# Altium schematic sheet RK3399_Display_HDMI_EDP.SchDoc
size A4; SheetNumber: 8; SheetTotal: 20
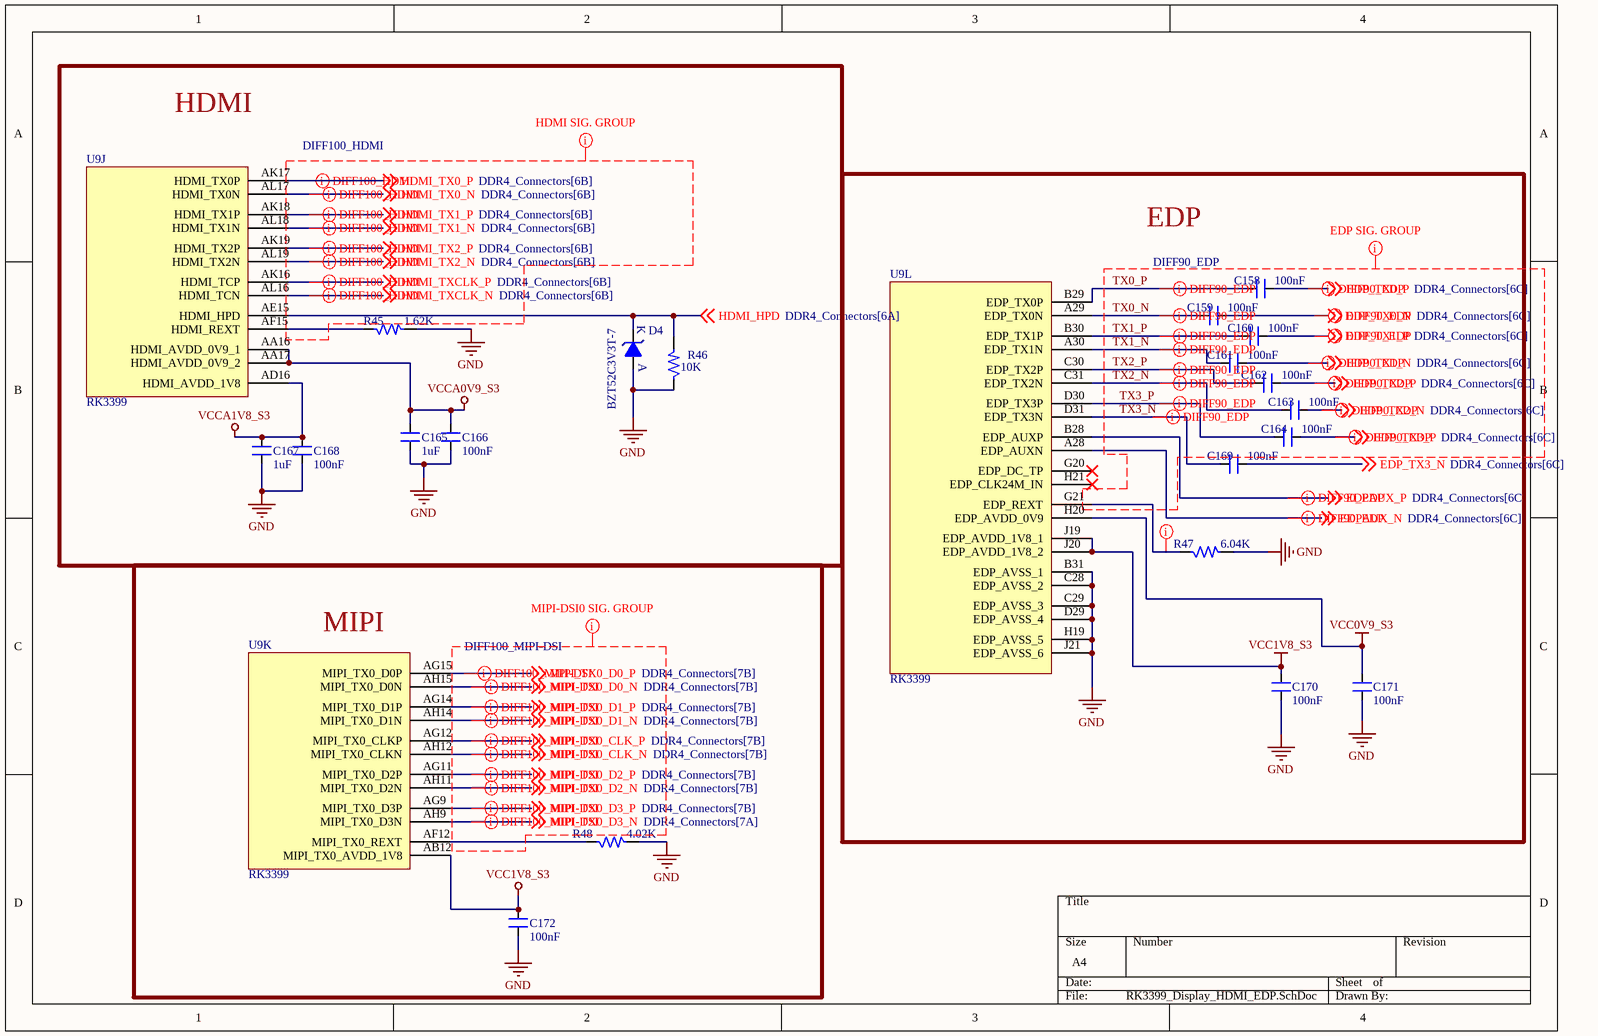
[diagram p0: RK3399_Display_HDMI_EDP.SchDoc]

## Parts
C158  100nF  [CAP_0201]
C159  100nF  [CAP_0201]
C160  100nF  [CAP_0201]
C161  100nF  [CAP_0201]
C162  100nF  [CAP_0201]
C163  100nF  [CAP_0201]
C164  100nF  [CAP_0201]
C165  1uF  [CAP_0201]
C166  100nF  [CAP_0201]
C167  1uF  [CAP_0201]
C168  100nF  [CAP_0201]
C169  100nF  [CAP_0201]
C170  100nF  [CAP_0201]
C171  100nF  [CAP_0201]
C172  100nF  [CAP_0201]
D4  BZT52C3V3T-7  [DIO_SOD523]
R45  1.62K  [RES_0201]
R46  10K  [RES_0201]
R47  6.04K  [RES_0201]
R48  4.02K  [RES_0201]
U9  RK3399  [FBGA828_23_826X826]  (parts J,K,L of 24)

## Blocks framed on the sheet
HDMI: C165-C168 D4 R45 R46 U9
EDP: C158-C164 C169-C171 R47 U9
MIPI: C172 R48 U9

## Nets
GND: C165.1 C166.1 C167.1 C168.1 C170.2 C171.2 C172.1 D4.A R45.2 R46.1 R47.2 R48.2 U9.B31(EDP_AVSS_1) U9.C28(EDP_AVSS_2) U9.C29(EDP_AVSS_3) U9.D29(EDP_AVSS_4) U9.H19(EDP_AVSS_5) U9.J21(EDP_AVSS_6)
VCC0V9_S3: C171.1 U9.H20(EDP_AVDD_0V9)
VCC1V8_S3: C170.1 C172.2 U9.AB12(MIPI_TX0_AVDD_1V8) U9.J19(EDP_AVDD_1V8_1) U9.J20(EDP_AVDD_1V8_2)
VCCA0V9_S3: C165.2 C166.2 U9.AA16(HDMI_AVDD_0V9_1) U9.AA17(HDMI_AVDD_0V9_2)
VCCA1V8_S3: C167.2 C168.2 U9.AD16(HDMI_AVDD_1V8)
EDP_TX0_N: C159.1 ; off-sheet EDP_TX0_N
EDP_TX0_P: C158.1 ; off-sheet EDP_TX0_P
EDP_TX1_N: C161.1 ; off-sheet EDP_TX1_N
EDP_TX1_P: C160.1 ; off-sheet EDP_TX1_P
EDP_TX2_N: C163.1 ; off-sheet EDP_TX2_N
EDP_TX2_P: C162.1 ; off-sheet EDP_TX2_P
EDP_TX3_N: C169.1 ; off-sheet EDP_TX3_N
EDP_TX3_P: C164.1 ; off-sheet EDP_TX3_P
EDPAUX_N: U9.A28(EDP_AUXN) ; off-sheet EDPAUX_N
EDPAUX_P: U9.B28(EDP_AUXP) ; off-sheet EDPAUX_P
HDMI_HPD: D4.K R46.2 U9.AE15(HDMI_HPD) ; off-sheet HDMI_HPD
HDMI_TX0_N: U9.AL17(HDMI_TX0N) ; off-sheet HDMI_TX0_N
HDMI_TX0_P: U9.AK17(HDMI_TX0P) ; off-sheet HDMI_TX0_P
HDMI_TX1_N: U9.AL18(HDMI_TX1N) ; off-sheet HDMI_TX1_N
HDMI_TX1_P: U9.AK18(HDMI_TX1P) ; off-sheet HDMI_TX1_P
HDMI_TX2_N: U9.AL19(HDMI_TX2N) ; off-sheet HDMI_TX2_N
HDMI_TX2_P: U9.AK19(HDMI_TX2P) ; off-sheet HDMI_TX2_P
HDMI_TXCLK_N: U9.AL16(HDMI_TCN) ; off-sheet HDMI_TXCLK_N
HDMI_TXCLK_P: U9.AK16(HDMI_TCP) ; off-sheet HDMI_TXCLK_P
MIPI_TX0_CLK_N: U9.AH12(MIPI_TX0_CLKN) ; off-sheet MIPI_TX0_CLK_N
MIPI_TX0_CLK_P: U9.AG12(MIPI_TX0_CLKP) ; off-sheet MIPI_TX0_CLK_P
MIPI_TX0_D0_N: U9.AH15(MIPI_TX0_D0N) ; off-sheet MIPI_TX0_D0_N
MIPI_TX0_D0_P: U9.AG15(MIPI_TX0_D0P) ; off-sheet MIPI_TX0_D0_P
MIPI_TX0_D1_N: U9.AH14(MIPI_TX0_D1N) ; off-sheet MIPI_TX0_D1_N
MIPI_TX0_D1_P: U9.AG14(MIPI_TX0_D1P) ; off-sheet MIPI_TX0_D1_P
MIPI_TX0_D2_N: U9.AH11(MIPI_TX0_D2N) ; off-sheet MIPI_TX0_D2_N
MIPI_TX0_D2_P: U9.AG11(MIPI_TX0_D2P) ; off-sheet MIPI_TX0_D2_P
MIPI_TX0_D3_N: U9.AH9(MIPI_TX0_D3N) ; off-sheet MIPI_TX0_D3_N
MIPI_TX0_D3_P: U9.AG9(MIPI_TX0_D3P) ; off-sheet MIPI_TX0_D3_P
TX0_N: C159.2 U9.A29(EDP_TX0N)
TX0_P: C158.2 U9.B29(EDP_TX0P)
TX1_N: C161.2 U9.A30(EDP_TX1N)
TX1_P: C160.2 U9.B30(EDP_TX1P)
TX2_N: C163.2 U9.C31(EDP_TX2N)
TX2_P: C162.2 U9.C30(EDP_TX2P)
TX3_N: C169.2 U9.D31(EDP_TX3N)
TX3_P: C164.2 U9.D30(EDP_TX3P)
NetR45_1: R45.1 U9.AF15(HDMI_REXT)
NetR47_1: R47.1 U9.G21(EDP_REXT)
NetR48_1: R48.1 U9.AF12(MIPI_TX0_REXT)

Not connected (* = marked no-connect by the designer): U9 G20(EDP_DC_TP)* H21(EDP_CLK24M_IN)*

## Layout directives
net class EDP_GROUP: NetR47_1
differential pair; differential pair class DIFF100_HDMI: HDMI_TX0_N, HDMI_TX0_P, HDMI_TX1_N, HDMI_TX1_P, HDMI_TX2_N, HDMI_TX2_P, HDMI_TXCLK_N, HDMI_TXCLK_P
differential pair; differential pair class DIFF100_MIPI-DSI: MIPI_TX0_CLK_N, MIPI_TX0_CLK_P, MIPI_TX0_D0_N, MIPI_TX0_D0_P, MIPI_TX0_D1_N, MIPI_TX0_D1_P, MIPI_TX0_D2_N, MIPI_TX0_D2_P, MIPI_TX0_D3_N, MIPI_TX0_D3_P
differential pair; differential pair class DIFF90_EDP: EDP_TX0_N, EDP_TX0_P, EDP_TX1_N, EDP_TX1_P, EDP_TX2_N, EDP_TX2_P, EDP_TX3_P, EDPAUX_N, EDPAUX_P, TX0_N, TX0_P, TX1_N, TX1_P, TX2_N, TX2_P, TX3_N, TX3_P
net class EDP SIG. GROUP: EDP_TX0_N, EDP_TX0_P, EDP_TX1_N, EDP_TX1_P, EDP_TX2_N, EDP_TX2_P, EDP_TX3_P, TX0_N, TX0_P, TX1_N, TX1_P, TX2_N, TX2_P, TX3_N, TX3_P
net class HDMI SIG. GROUP: HDMI_TX0_N, HDMI_TX0_P, HDMI_TX1_N, HDMI_TX1_P, HDMI_TX2_N, HDMI_TX2_P, HDMI_TXCLK_N, HDMI_TXCLK_P
net class MIPI-DSI0 SIG. GROUP: MIPI_TX0_CLK_N, MIPI_TX0_CLK_P, MIPI_TX0_D0_N, MIPI_TX0_D0_P, MIPI_TX0_D1_N, MIPI_TX0_D1_P, MIPI_TX0_D2_N, MIPI_TX0_D2_P, MIPI_TX0_D3_N, MIPI_TX0_D3_P

## Library data of the parts
C158-C164 C166 C168-C172 = CAP_100nF-25V-10%-0201: 0.1µF ±10% 25V Ceramic Capacitor X5R 0201 (0603 Metric); Manufacturer: TDK Corporation; Manufacturer Part Number: C0603X5R1E104K030BB; Case/Package: 0201; Supplier-1: Digikey
C165 C167 = CAP_1uF-16V-10%-0201: 1µF ±20% 16V Ceramic Capacitor X5R 0201 (0603 Metric); Manufacturer: Samsung Electro-Mechanics; Manufacturer Part Number: CL03A105MO3NRNH; Case/Package: 0201; Supplier-1: Digikey
D4 = DIO-Z_3.3V-300mW-SOD-523: Zener Diode 3.3V 300mW ±6% Surface Mount SOD-523; Manufacturer: Diodes Incorporated; Manufacturer Part Number: BZT52C3V3T-7; Case/Package: SOD523; Supplier-1: Digikey
R45 = RES_1.62K-0.05W-1%-0201: 1.62 kOhms ±1% 0.05W, 1/20W Chip Resistor 0201 (0603 Metric) Automotive AEC-Q200 Thick Film; Manufacturer: Panasonic Electronic Components; Manufacturer Part Number: ERJ-1GNF1621C; Case/Package: 0201; Supplier-1: Digikey
R46 = RES_10K-0.05W-1%-0201: 10 kOhms ±1% 0.05W, 1/20W Chip Resistor 0201 (0603 Metric) Thick Film; Manufacturer: Stackpole Electronics Inc; Manufacturer Part Number: RMCF0201FT10K0; Case/Package: 0201; Supplier-1: Digikey
R47 = RES_6.04K-0.05W-1%-0201: 6.04 kOhms ±1% 0.05W, 1/20W Chip Resistor 0201 (0603 Metric) Thick Film; Manufacturer: Panasonic Electronic Components; Manufacturer Part Number: ERJ-1GEF6041C; Case/Package: 0201; Supplier-1: Digikey
R48 = RES_4.02K-0.05W-1%-0201: 4.02 kOhms ±1% 0.05W, 1/20W Chip Resistor 0201 (0603 Metric) Thick Film; Manufacturer: Yageo; Manufacturer Part Number: RC0201FR-074K02L; Case/Package: 0201; Supplier-1: Digikey
U9 = IC_RK3399-FCBGA828: RK3399 is a low power, high performance processor for computing, personal mobile.; Manufacturer: Rockchip; Manufacturer Part Number: RK3399; Case/Package: FCBGA828; Supplier-1: Rockchip